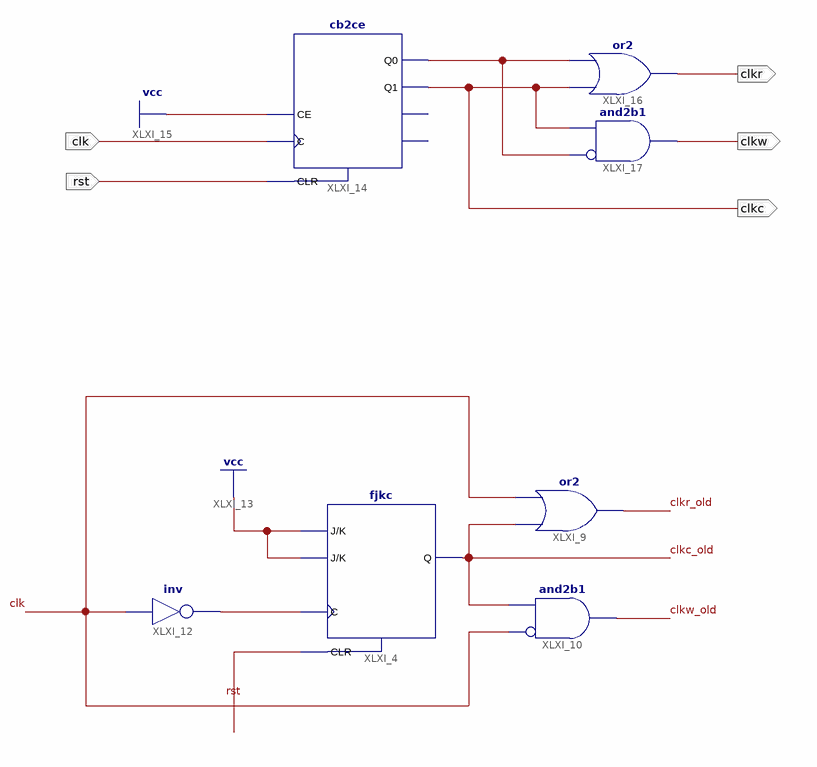
[diagram p0: schematic sheet 1]
// Xilinx ISE schematic clk_generator.sch (aspartan6) as structural Verilog: 7 symbols, 5 ports
module clk_generator (
  input  rst,
  input  clk,
  output clkc,
  output clkr,
  output clkw
);

  wire clkc_old, clkr_old, clkw_old, XLXN_9, XLXN_13;

  fjkc XLXI_4 (.C(XLXN_9), .CLR(rst), .J(1'b1), .K(1'b1), .Q(clkc_old));
  or XLXI_9 (clkr_old, clkc_old, clk);
  and XLXI_10 (clkw_old, ~clk, clkc_old);  // and2b1
  not XLXI_12 (XLXN_9, clk);
  cb2ce XLXI_14 (.C(clk), .CE(1'b1), .CLR(rst), .Q0(XLXN_13), .Q1(clkc));  // open: CEO, TC
  or XLXI_16 (clkr, clkc, XLXN_13);
  and XLXI_17 (clkw, ~XLXN_13, clkc);  // and2b1
endmodule
